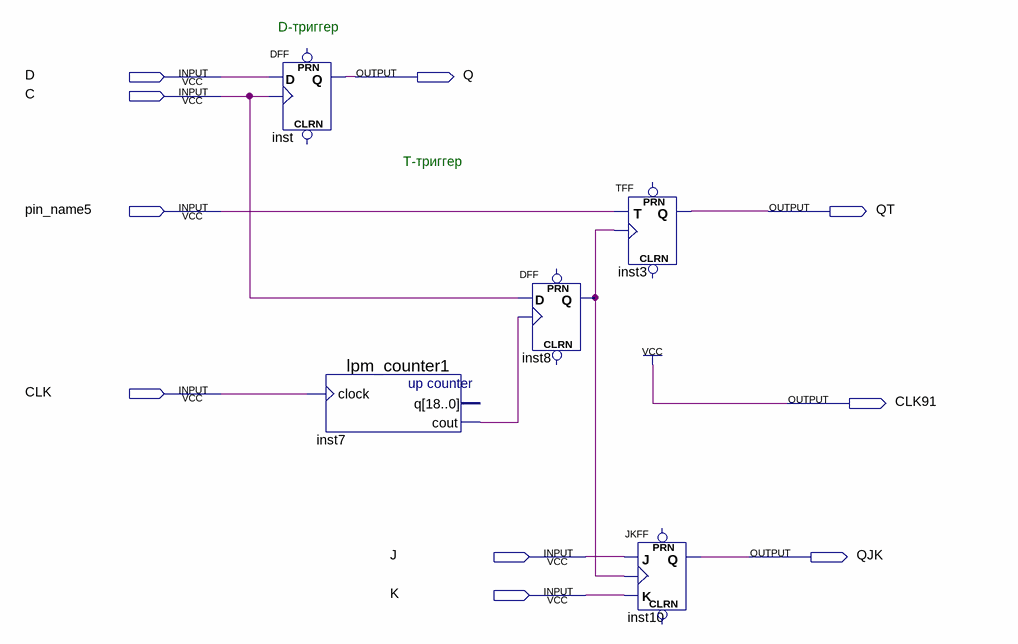
[diagram p0: schematic sheet]
// Quartus schematic D_T_JK-trigger.bdf as structural Verilog: 5 symbols, 10 pins
module \D_T_JK-trigger  (
  input  D,
  input  C,
  input  pin_name5,
  input  CLK,
  input  J,
  input  K,
  output Q,
  output QT,
  output CLK91,
  output QJK
);

  wire inst7_cout, inst8_q;

  DFF inst (.CLK(C), .D(D), .Q(Q));  // open: CLRN, PRN
  lpm_counter1 inst7 (.clock(CLK), .cout(inst7_cout));  // open: q
  DFF inst8 (.CLK(inst7_cout), .D(C), .Q(inst8_q));  // open: CLRN, PRN
  TFF inst3 (.T(pin_name5), .CLK(inst8_q), .Q(QT));  // open: PRN, CLRN
  JKFF inst10 (.K(K), .J(J), .CLK(inst8_q), .Q(QJK));  // open: PRN, CLRN

  assign CLK91 = 1'b1;

  // Notes on the sheet:
  //   D-триггер
  //   Т-триггер
endmodule
